# Altium project DIO_MCX_Isolated.PrjPCB (part 3 of 3)
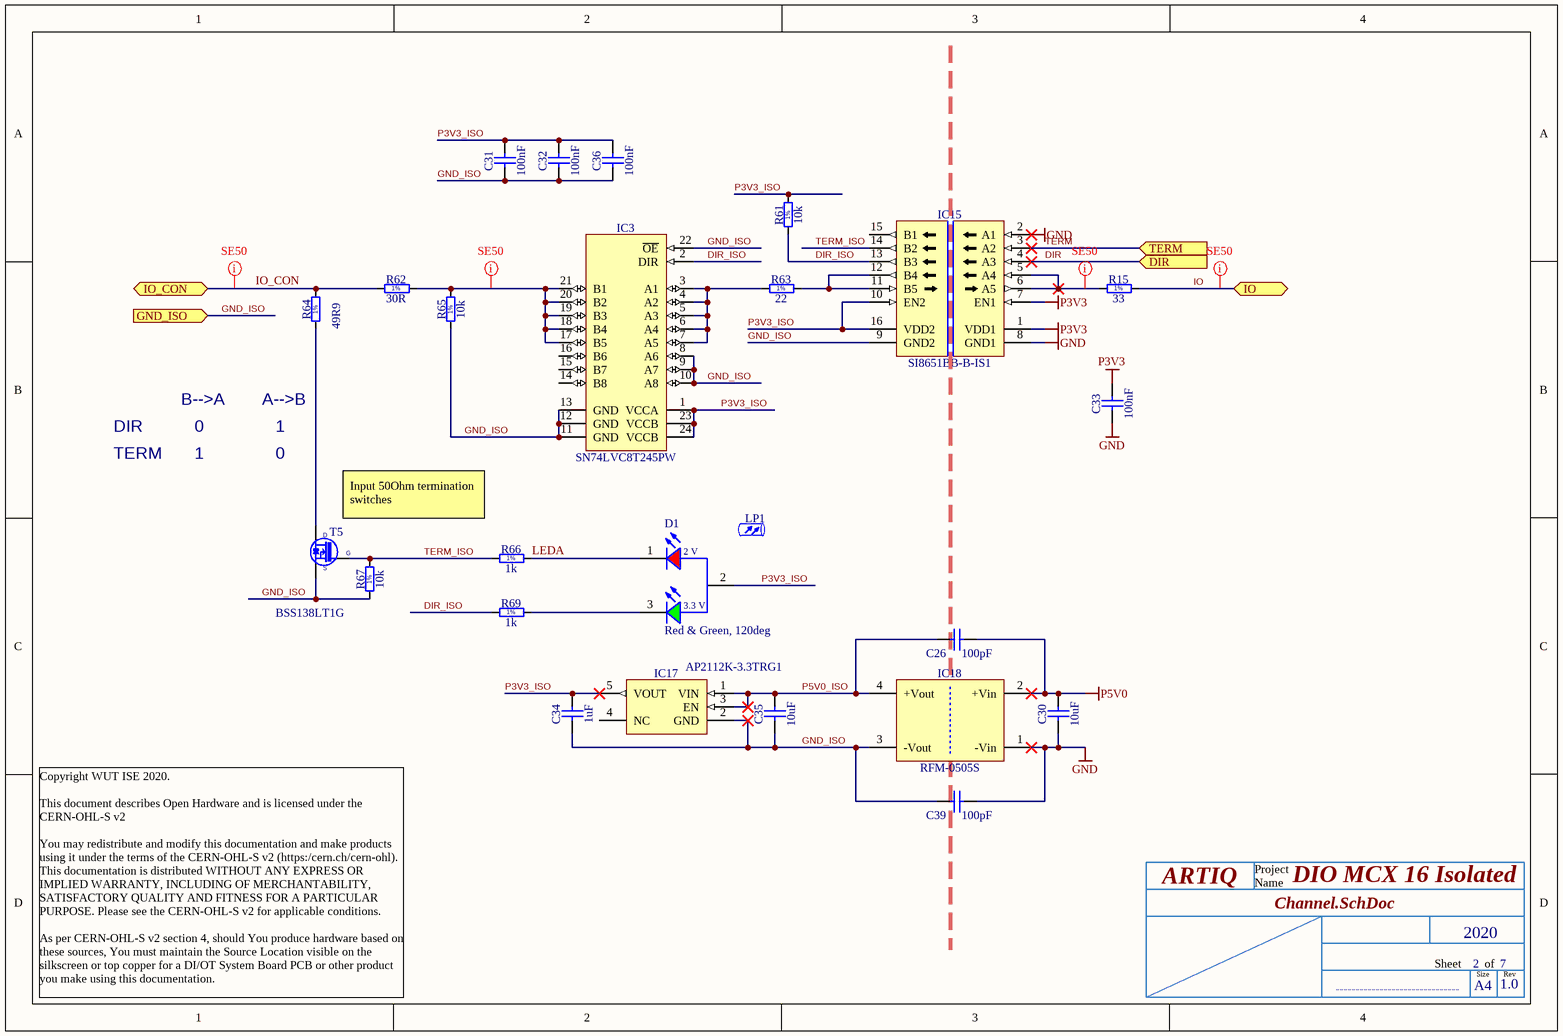
[diagram p7: Channel.SchDoc]

## Nets that join several sheets
GND: DIO_MCX_Isolated (38 pins), DIO_MCX_Supply (33 pins), U_LVDS_IFCA (28 pins), U_LVDS_IFCB (28 pins), ID_logic (26 pins), P1 (24 pins), P6 (30 pins), U_Channel1 (6 pins), U_Channel2 (6 pins), U_Channel3 (6 pins), U_Channel4 (6 pins), U_Channel5 (6 pins), U_Channel6 (6 pins), U_Channel7 (6 pins), U_Channel8 (6 pins)
P3V3: DIO_MCX_Isolated (11 pins), DIO_MCX_Supply (6 pins), U_LVDS_IFCA (26 pins), U_LVDS_IFCB (26 pins), U_Channel1 (C33A.2 IC15A.1 IC15A.7), U_Channel2 (C33B.2 IC15B.1 IC15B.7), U_Channel3 (C33C.2 IC15C.1 IC15C.7), U_Channel4 (C33D.2 IC15D.1 IC15D.7), U_Channel5 (C33E.2 IC15E.1 IC15E.7), U_Channel6 (C33F.2 IC15F.1 IC15F.7), U_Channel7 (C33G.2 IC15G.1 IC15G.7), U_Channel8 (C33H.2 IC15H.1 IC15H.7)
P3V3_MP: DIO_MCX_Isolated (8 pins), DIO_MCX_Supply (B3.1 C38.2 IC11.5 R10.1), ID_logic (18 pins)
P5V0: DIO_MCX_Isolated (J1.1 J1.2), DIO_MCX_Supply (16 pins), U_Channel1 (C26A.2 C30A.2 IC18A.2), U_Channel2 (C26B.2 C30B.2 IC18B.2), U_Channel3 (C26C.2 C30C.2 IC18C.2), U_Channel4 (C26D.2 C30D.2 IC18D.2), U_Channel5 (C26E.2 C30E.2 IC18E.2), U_Channel6 (C26F.2 C30F.2 IC18F.2), U_Channel7 (C26G.2 C30G.2 IC18G.2), U_Channel8 (C26H.2 C30H.2 IC18H.2)
P5V0_MP: DIO_MCX_Supply (C37.2 IC11.1 IC11.3), P1 (J20.B1)
P12V0: DIO_MCX_Supply (14 pins), P1 (7 pins)
BUS_SCL: ID_logic (6 pins), P1 (D2.1 J20.B2)
BUS_SDA: ID_logic (6 pins), P1 (D2.6 J20.C2)
DIR: DIO_MCX_Isolated (IC10.8 SW1.1), U_Channel1 (IC15A.4)
DIR: DIO_MCX_Isolated (IC10.6 SW1.2), U_Channel2 (IC15B.4)
DIR: DIO_MCX_Isolated (IC10.4 SW1.3), U_Channel3 (IC15C.4)
DIR: DIO_MCX_Isolated (IC10.2 SW1.4), U_Channel4 (IC15D.4)
DIR: DIO_MCX_Isolated (IC10.21 SW9.1), U_Channel5 (IC15E.4)
DIR: DIO_MCX_Isolated (IC10.23 SW9.2), U_Channel6 (IC15F.4)
DIR: DIO_MCX_Isolated (IC10.25 SW9.3), U_Channel7 (IC15G.4)
DIR: DIO_MCX_Isolated (IC10.27 SW9.4), U_Channel8 (IC15H.4)
GA0: ID_logic (IC7.15 R58.1), P1 (D3.6 J20.C3)
GA1: ID_logic (IC7.16 R59.1), P1 (D3.4 J20.F3)
GA2: ID_logic (IC7.17 R57.1), P1 (D3.3 J20.I3)
GND_ISO: DIO_MCX_Isolated (J0.2), U_Channel1 (19 pins)
GND_ISO: DIO_MCX_Isolated (J2.2), U_Channel2 (19 pins)
GND_ISO: DIO_MCX_Isolated (J4.2), U_Channel3 (19 pins)
GND_ISO: DIO_MCX_Isolated (J6.2), U_Channel4 (19 pins)
GND_ISO: DIO_MCX_Isolated (J8.2), U_Channel5 (19 pins)
GND_ISO: DIO_MCX_Isolated (J10.2), U_Channel6 (19 pins)
GND_ISO: DIO_MCX_Isolated (J12.2), U_Channel7 (19 pins)
GND_ISO: DIO_MCX_Isolated (J14.2), U_Channel8 (19 pins)
I2C0_SCL: DIO_MCX_Isolated (B8.1 IC8.12 IC10.12 J1.4), ID_logic (IC13.2 IC13.3)
I2C0_SDA: DIO_MCX_Isolated (B7.1 IC8.13 IC10.13 J1.3), ID_logic (IC13.9 IC13.10)
IO: U_LVDS_IFCA (R17A.1), U_Channel4 (R15D.2)
IO: U_LVDS_IFCA (R18A.1), U_Channel3 (R15C.2)
IO: U_LVDS_IFCA (R19A.1), U_Channel2 (R15B.2)
IO: U_LVDS_IFCA (R20A.1), U_Channel1 (R15A.2)
IO: U_LVDS_IFCA (R22A.1), U_Channel5 (R15E.2)
IO: U_LVDS_IFCA (R23A.1), U_Channel6 (R15F.2)
IO: U_LVDS_IFCA (R25A.1), U_Channel7 (R15G.2)
IO: U_LVDS_IFCA (R26A.1), U_Channel8 (R15H.2)
IO1: DIO_MCX_Isolated (J1.30), U_LVDS_IFCB (R17B.1)
IO3: DIO_MCX_Isolated (J1.27), U_LVDS_IFCB (R18B.1)
IO5: DIO_MCX_Isolated (J1.26), U_LVDS_IFCB (R19B.1)
IO7: DIO_MCX_Isolated (J1.23), U_LVDS_IFCB (R20B.1)
IO9: DIO_MCX_Isolated (J1.22), U_LVDS_IFCB (R26B.1)
IO11: DIO_MCX_Isolated (J1.19), U_LVDS_IFCB (R25B.1)
IO13: DIO_MCX_Isolated (J1.18), U_LVDS_IFCB (R23B.1)
IO15: DIO_MCX_Isolated (J1.15), U_LVDS_IFCB (R22B.1)
IO_CON: DIO_MCX_Isolated (J0.1), U_Channel1 (R62A.1 R64A.2)
IO_CON: DIO_MCX_Isolated (J2.1), U_Channel2 (R62B.1 R64B.2)
IO_CON: DIO_MCX_Isolated (J4.1), U_Channel3 (R62C.1 R64C.2)
IO_CON: DIO_MCX_Isolated (J6.1), U_Channel4 (R62D.1 R64D.2)
IO_CON: DIO_MCX_Isolated (J8.1), U_Channel5 (R62E.1 R64E.2)
IO_CON: DIO_MCX_Isolated (J10.1), U_Channel6 (R62F.1 R64F.2)
IO_CON: DIO_MCX_Isolated (J12.1), U_Channel7 (R62G.1 R64G.2)
IO_CON: DIO_MCX_Isolated (J14.1), U_Channel8 (R62H.1 R64H.2)
LVDS1_N: U_LVDS_IFCA (IC1A.48 R7A.2), P6 (J15.B1)
LVDS1_N: U_LVDS_IFCB (IC1B.48 R7B.2), P1 (J20.L6)
LVDS1_P: U_LVDS_IFCA (IC1A.47 R7A.1), P6 (J15.A1)
LVDS1_P: U_LVDS_IFCB (IC1B.47 R7B.1), P1 (J20.K6)
LVDS2_N: U_LVDS_IFCA (IC1A.4 R9A.2), P6 (J15.E1)
LVDS2_N: U_LVDS_IFCB (IC1B.4 R9B.2), P1 (J20.H5)
LVDS2_P: U_LVDS_IFCA (IC1A.3 R9A.1), P6 (J15.D1)
LVDS2_P: U_LVDS_IFCB (IC1B.3 R9B.1), P1 (J20.G5)
LVDS3_N: U_LVDS_IFCA (IC1A.10 R11A.2), P6 (J15.H1)
LVDS3_N: U_LVDS_IFCB (IC1B.10 R11B.2), P1 (J20.I4)
LVDS3_P: U_LVDS_IFCA (IC1A.9 R11A.1), P6 (J15.G1)
LVDS3_P: U_LVDS_IFCB (IC1B.9 R11B.1), P1 (J20.H4)
LVDS4_N: U_LVDS_IFCA (IC1A.14 R13A.2), P6 (J15.K1)
LVDS4_N: U_LVDS_IFCB (IC1B.14 R13B.2), P1 (J20.B3)
LVDS4_P: U_LVDS_IFCA (IC1A.13 R13A.1), P6 (J15.J1)
LVDS4_P: U_LVDS_IFCB (IC1B.13 R13B.1), P1 (J20.A3)
LVDS5_N: U_LVDS_IFCA (IC6A.48 R16A.2), P1 (J20.B5)
LVDS5_N: U_LVDS_IFCB (IC6B.48 R16B.2), P1 (J20.E3)
LVDS5_P: U_LVDS_IFCA (IC6A.47 R16A.1), P1 (J20.A5)
LVDS5_P: U_LVDS_IFCB (IC6B.47 R16B.1), P1 (J20.D3)
LVDS6_N: U_LVDS_IFCA (IC6A.4 R21A.2), P1 (J20.C6)
LVDS6_N: U_LVDS_IFCB (IC6B.4 R21B.2), P1 (J20.L4)
LVDS6_P: U_LVDS_IFCA (IC6A.3 R21A.1), P1 (J20.B6)
LVDS6_P: U_LVDS_IFCB (IC6B.3 R21B.1), P1 (J20.K4)
LVDS7_N: U_LVDS_IFCA (IC6A.10 R24A.2), P1 (J20.F6)
LVDS7_N: U_LVDS_IFCB (IC6B.10 R24B.2), P1 (J20.K5)
LVDS7_P: U_LVDS_IFCA (IC6A.9 R24A.1), P1 (J20.E6)
LVDS7_P: U_LVDS_IFCB (IC6B.9 R24B.1), P1 (J20.J5)
LVDS8_N: U_LVDS_IFCA (IC6A.14 R5A.2), P1 (J20.I6)
LVDS8_N: U_LVDS_IFCB (IC6B.14 R5B.2), P1 (J20.C4)
LVDS8_P: U_LVDS_IFCA (IC6A.13 R5A.1), P1 (J20.H6)
LVDS8_P: U_LVDS_IFCB (IC6B.13 R5B.1), P1 (J20.B4)
NetIC1A_20: DIO_MCX_Isolated (R30.1 R31.1), U_LVDS_IFCA (8 pins), U_LVDS_IFCB (8 pins)
~{RE}_DE1A: DIO_MCX_Isolated (IC8.26), U_LVDS_IFCA (IC1A.1 IC1A.40)
~{RE}_DE1B: DIO_MCX_Isolated (IC8.1), U_LVDS_IFCB (IC1B.1 IC1B.40)
~{RE}_DE2A: DIO_MCX_Isolated (IC8.25), U_LVDS_IFCA (IC1A.5 IC1A.42)
~{RE}_DE2B: DIO_MCX_Isolated (IC8.2), U_LVDS_IFCB (IC1B.5 IC1B.42)
~{RE}_DE3A: DIO_MCX_Isolated (IC8.27), U_LVDS_IFCA (IC1A.8 IC1A.19)
~{RE}_DE3B: DIO_MCX_Isolated (IC8.3), U_LVDS_IFCB (IC1B.8 IC1B.19)
~{RE}_DE4A: DIO_MCX_Isolated (IC8.28), U_LVDS_IFCA (IC1A.12 IC1A.21)
~{RE}_DE4B: DIO_MCX_Isolated (IC8.4), U_LVDS_IFCB (IC1B.12 IC1B.21)
~{RE}_DE5A: DIO_MCX_Isolated (IC8.24), U_LVDS_IFCA (IC6A.1 IC6A.40)
~{RE}_DE5B: DIO_MCX_Isolated (IC8.7), U_LVDS_IFCB (IC6B.1 IC6B.40)
~{RE}_DE6A: DIO_MCX_Isolated (IC8.23), U_LVDS_IFCA (IC6A.5 IC6A.42)
~{RE}_DE6B: DIO_MCX_Isolated (IC8.8), U_LVDS_IFCB (IC6B.5 IC6B.42)
~{RE}_DE7A: DIO_MCX_Isolated (IC8.21), U_LVDS_IFCA (IC6A.8 IC6A.19)
~{RE}_DE7B: DIO_MCX_Isolated (IC8.5), U_LVDS_IFCB (IC6B.8 IC6B.19)
~{RE}_DE8A: DIO_MCX_Isolated (IC8.22), U_LVDS_IFCA (IC6A.12 IC6A.21)
~{RE}_DE8B: DIO_MCX_Isolated (IC8.6), U_LVDS_IFCB (IC6B.12 IC6B.21)
SERVMOD_N: ID_logic (R46.2 R51.2 R60.2), P1 (D2.3 R28.1)
TERM: DIO_MCX_Isolated (IC10.1 SW5.4), U_Channel4 (IC15D.3)
TERM: DIO_MCX_Isolated (IC10.3 SW5.3), U_Channel3 (IC15C.3)
TERM: DIO_MCX_Isolated (IC10.5 SW5.2), U_Channel2 (IC15B.3)
TERM: DIO_MCX_Isolated (IC10.7 SW5.1), U_Channel1 (IC15A.3)
TERM: DIO_MCX_Isolated (IC10.22 SW6.1), U_Channel5 (IC15E.3)
TERM: DIO_MCX_Isolated (IC10.24 SW6.2), U_Channel6 (IC15F.3)
TERM: DIO_MCX_Isolated (IC10.26 SW6.3), U_Channel7 (IC15G.3)
TERM: DIO_MCX_Isolated (IC10.28 SW6.4), U_Channel8 (IC15H.3)

## Assembly variants
Default: not fitted C26A C26B C26C C26D C26E C26F C26G C26H C39A C39B C39C C39D C39E C39F C39G C39H R27